# EAGLE design USB-Octomod_02 (EAGLE 6.3)
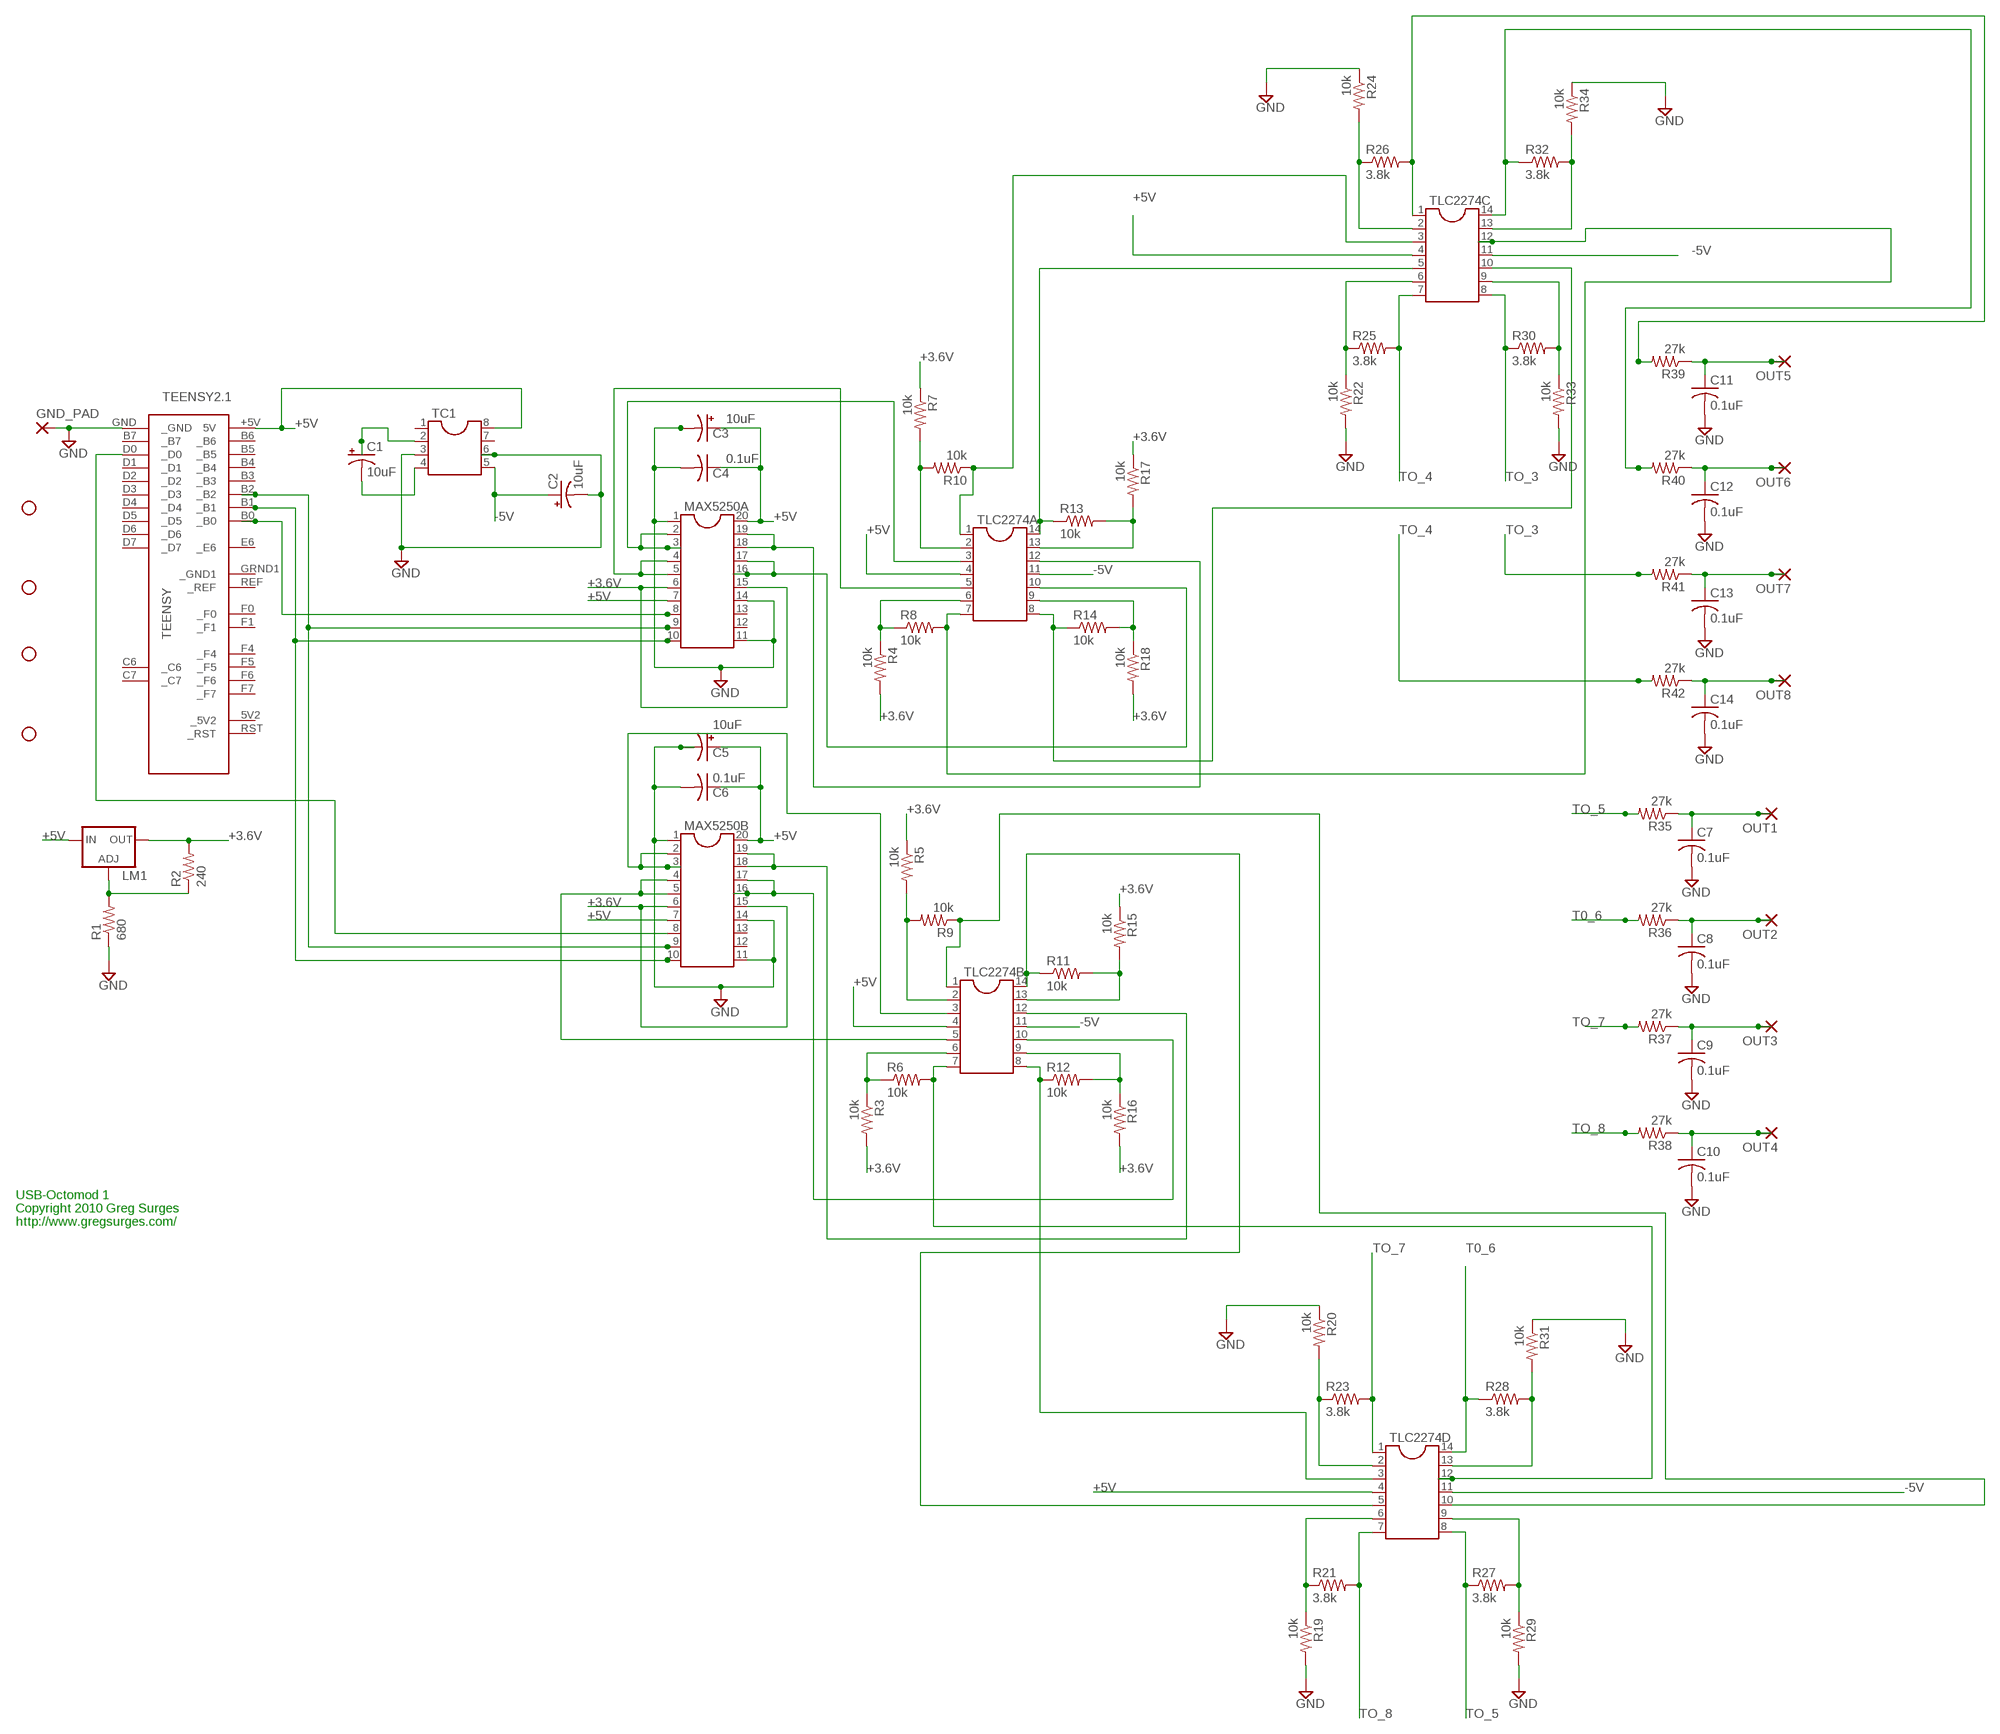
[diagram p0: schematic, sheet 1]

## Parts
C1  10uF  CPOL-USE2.5-6  [E2,5-6]
C2  10uF  CPOL-USE2.5-6  [E2,5-6]
C3  10uF  CPOL-USE2.5-6  [E2,5-6]
C4  0.1uF  C-US025-040X050  [C025-040X050]
C5  10uF  CPOL-USE2.5-6  [E2,5-6]
C6  0.1uF  C-US025-040X050  [C025-040X050]
C7  0.1uF  C-US025-040X050  [C025-040X050]
C8  0.1uF  C-US025-040X050  [C025-040X050]
C9  0.1uF  C-US025-040X050  [C025-040X050]
C10  0.1uF  C-US025-040X050  [C025-040X050]
C11  0.1uF  C-US025-040X050  [C025-040X050]
C12  0.1uF  C-US025-040X050  [C025-040X050]
C13  0.1uF  C-US025-040X050  [C025-040X050]
C14  0.1uF  C-US025-040X050  [C025-040X050]
GND_PAD  2,15/1,0  [2,15/1,0]
JP1  STAND-OFF  [STAND-OFF]
JP2  STAND-OFF  [STAND-OFF]
JP3  STAND-OFF  [STAND-OFF]
JP4  STAND-OFF  [STAND-OFF]
LM1  LM317TL  [317TL]
MAX5250A  DIL20  [DIL20]
MAX5250B  DIL20  [DIL20]
OUT1  2,15/1,0  [2,15/1,0]
OUT2  2,15/1,0  [2,15/1,0]
OUT3  2,15/1,0  [2,15/1,0]
OUT4  2,15/1,0  [2,15/1,0]
OUT5  2,15/1,0  [2,15/1,0]
OUT6  2,15/1,0  [2,15/1,0]
OUT7  2,15/1,0  [2,15/1,0]
OUT8  2,15/1,0  [2,15/1,0]
R1  680  R-US_0207/10  [0207/10]
R2  240  R-US_0207/10  [0207/10]
R3  10k  R-US_0207/10  [0207/10]
R4  10k  R-US_0207/10  [0207/10]
R5  10k  R-US_0207/10  [0207/10]
R6  10k  R-US_0207/10  [0207/10]
R7  10k  R-US_0207/10  [0207/10]
R8  10k  R-US_0207/10  [0207/10]
R9  10k  R-US_0207/10  [0207/10]
R10  10k  R-US_0207/10  [0207/10]
R11  10k  R-US_0207/10  [0207/10]
R12  10k  R-US_0207/10  [0207/10]
R13  10k  R-US_0207/10  [0207/10]
R14  10k  R-US_0207/10  [0207/10]
R15  10k  R-US_0207/10  [0207/10]
R16  10k  R-US_0207/10  [0207/10]
R17  10k  R-US_0207/10  [0207/10]
R18  10k  R-US_0207/10  [0207/10]
R19  10k  R-US_0207/10  [0207/10]
R20  10k  R-US_0207/10  [0207/10]
R21  3.8k  R-US_0207/10  [0207/10]
R22  10k  R-US_0207/10  [0207/10]
R23  3.8k  R-US_0207/10  [0207/10]
R24  10k  R-US_0207/10  [0207/10]
R25  3.8k  R-US_0207/10  [0207/10]
R26  3.8k  R-US_0207/10  [0207/10]
R27  3.8k  R-US_0207/10  [0207/10]
R28  3.8k  R-US_0207/10  [0207/10]
R29  10k  R-US_0207/10  [0207/10]
R30  3.8k  R-US_0207/10  [0207/10]
R31  10k  R-US_0207/10  [0207/10]
R32  3.8k  R-US_0207/10  [0207/10]
R33  10k  R-US_0207/10  [0207/10]
R34  10k  R-US_0207/10  [0207/10]
R35  27k  R-US_0207/10  [0207/10]
R36  27k  R-US_0207/10  [0207/10]
R37  27k  R-US_0207/10  [0207/10]
R38  27k  R-US_0207/10  [0207/10]
R39  27k  R-US_0207/10  [0207/10]
R40  27k  R-US_0207/10  [0207/10]
R41  27k  R-US_0207/10  [0207/10]
R42  27k  R-US_0207/10  [0207/10]
TC1  DIL8  [DIL08]
TEENSY2.1  TEENSY  [TEENSY]
TLC2274A  DIL14  [DIL14]
TLC2274B  DIL14  [DIL14]
TLC2274C  DIL14  [DIL14]
TLC2274D  DIL14  [DIL14]

## Nets
+3.6V: LM1.2(OUT) MAX5250A.6 MAX5250A.15 MAX5250B.6 MAX5250B.15 R2.2 R3.2 R4.2 R5.1 R7.1 R15.1 R16.2 R17.1 R18.2
+5V: C3.+ C4.1 C5.+ C6.1 LM1.3(IN) MAX5250A.7 MAX5250A.20 MAX5250B.7 MAX5250B.20 TC1.8 TEENSY2.1.+5V(5V) TLC2274A.4 TLC2274B.4 TLC2274C.4 TLC2274D.4
-5V: C2.+ TC1.5 TLC2274A.11 TLC2274B.11 TLC2274C.11 TLC2274D.11
GND: C2.- C3.- C4.2 C5.- C6.2 C7.2 C8.2 C9.2 C10.2 C11.2 C12.2 C13.2 C14.2 GND_PAD.1(P) MAX5250A.1 MAX5250A.11 MAX5250A.14 MAX5250B.1 MAX5250B.11 MAX5250B.14 R1.1 R19.2 R20.1 R22.2 R24.1 R29.2 R31.1 R33.2 R34.1 TC1.3 TC1.6 TEENSY2.1.GND(_GND)
N$1: MAX5250A.8 TEENSY2.1.B0(_B0)
N$2: MAX5250A.10 MAX5250B.10 TEENSY2.1.B1(_B1)
N$3: MAX5250A.9 MAX5250B.9 TEENSY2.1.B2(_B2)
N$4: C1.+ TC1.2
N$5: R10.1 TLC2274A.1 TLC2274C.3
N$6: LM1.1(ADJ) R1.2 R2.1
N$7: C1.- TC1.4
N$8: R7.2 R10.2 TLC2274A.2
N$9: C11.1 OUT5.1(P) R39.1
N$10: R4.1 R8.1 TLC2274A.6
N$11: R13.2 R17.2 TLC2274A.13
N$12: C12.1 OUT6.1(P) R40.1
N$13: C13.1 OUT7.1(P) R41.1
N$15: C14.1 OUT8.1(P) R42.1
N$16: R5.2 R9.2 TLC2274B.2
N$17: C7.1 OUT1.1(P) R35.1
N$18: R3.1 R6.1 TLC2274B.6
N$19: C8.1 OUT2.1(P) R36.1
N$20: C9.1 OUT3.1(P) R37.1
N$21: R11.2 R15.2 TLC2274B.13
N$22: C10.1 OUT4.1(P) R38.1
N$23: R14.2 R18.1 TLC2274A.9
N$24: R12.2 R16.1 TLC2274B.9
N$25: MAX5250B.8 TEENSY2.1.D0(_D0)
N$26: R24.2 R26.1 TLC2274C.2
N$27: R26.2 R39.2 TLC2274C.1
N$28: R32.2 R34.2 TLC2274C.13
N$29: R32.1 R40.2 TLC2274C.14
N$30: R22.1 R25.1 TLC2274C.6
N$32: R30.2 R33.1 TLC2274C.9
N$33: R20.2 R23.1 TLC2274D.2
N$35: R28.2 R31.2 TLC2274D.13
N$37: R19.1 R21.1 TLC2274D.6
N$38: R27.2 R29.1 TLC2274D.9
OUT2: R8.2 TLC2274A.7 TLC2274C.12
OUT3: R14.1 TLC2274A.8 TLC2274C.10
OUT4: R13.1 TLC2274A.14 TLC2274C.5
OUT6: R11.1 TLC2274B.14 TLC2274D.5
OUT8: R9.1 TLC2274B.1 TLC2274D.10
OUTA1: MAX5250A.2 MAX5250A.3 TLC2274A.3
OUTA2: MAX5250A.4 MAX5250A.5 TLC2274A.5
OUTA3: MAX5250A.18 MAX5250A.19 TLC2274A.12
OUTA4: MAX5250A.16 MAX5250A.17 TLC2274A.10
OUTB1: MAX5250B.2 MAX5250B.3 TLC2274B.3
OUTB2: MAX5250B.4 MAX5250B.5 TLC2274B.5
OUTB3: MAX5250B.18 MAX5250B.19 TLC2274B.12
OUTB4: MAX5250B.16 MAX5250B.17 TLC2274B.10
T0_6: R28.1 R36.2 TLC2274D.14
TO_3: R30.1 R41.2 TLC2274C.8
TO_4: R25.2 R42.2 TLC2274C.7
TO_5: R27.1 R35.2 TLC2274D.8
TO_7: R23.2 R37.2 TLC2274D.1
TO_8: R21.2 R38.2 TLC2274D.7
TT3: R12.1 TLC2274B.8 TLC2274D.3
TTT: R6.2 TLC2274B.7 TLC2274D.12
Unconnected: MAX5250A.12 MAX5250A.13 MAX5250B.12 MAX5250B.13 TC1.1 TC1.7 TEENSY2.1.5V2(_5V2) TEENSY2.1.B3(_B3) TEENSY2.1.B4(_B4) TEENSY2.1.B5(_B5) TEENSY2.1.B6(_B6) TEENSY2.1.B7(_B7) TEENSY2.1.C6(_C6) TEENSY2.1.C7(_C7) TEENSY2.1.D1(_D1) TEENSY2.1.D2(_D2) TEENSY2.1.D3(_D3) TEENSY2.1.D4(_D4) TEENSY2.1.D5(_D5) TEENSY2.1.D6(_D6) TEENSY2.1.D7(_D7) TEENSY2.1.E6(_E6) TEENSY2.1.F0(_F0) TEENSY2.1.F1(_F1) TEENSY2.1.F4(_F4) TEENSY2.1.F5(_F5) TEENSY2.1.F6(_F6) TEENSY2.1.F7(_F7) TEENSY2.1.GRND1(_GND1) TEENSY2.1.REF(_REF) TEENSY2.1.RST(_RST)

## Notes on the sheet
- USB-Octomod 1
- Copyright 2010 Greg Surges
- http://www.gregsurges.com/

## Library data of the parts
C1-C3 C5 = rcl:CPOL-US: POLARIZED CAPACITOR, American symbol
C4 C6-C14 = rcl:C-US: CAPACITOR, American symbol
GND_PAD OUT1-OUT8 = wirepad:2,15/1,0: THROUGH-HOLE PAD
JP1-JP4 = SparkFun:STAND-OFF: Stand Off This is the mechanical footprint for a #4 phillips button head screw. Use the keepout ring to avoid running the screw head into surrounding components. SKU : PRT-00447
LM1 = v-reg:LM317TL: VOLTAGE REGULATOR
MAX5250A MAX5250B = ic-package:DIL20: Dual In Line / Socket
R1-R42 = rcl:R-US_: RESISTOR, American symbol
TC1 = ic-package:DIL8: Dual In Line / Socket
TEENSY2.1 = teensy:TEENSY: Teensy 2.0
TLC2274A TLC2274B TLC2274C TLC2274D = ic-package:DIL14: Dual In Line / Socket

## Board
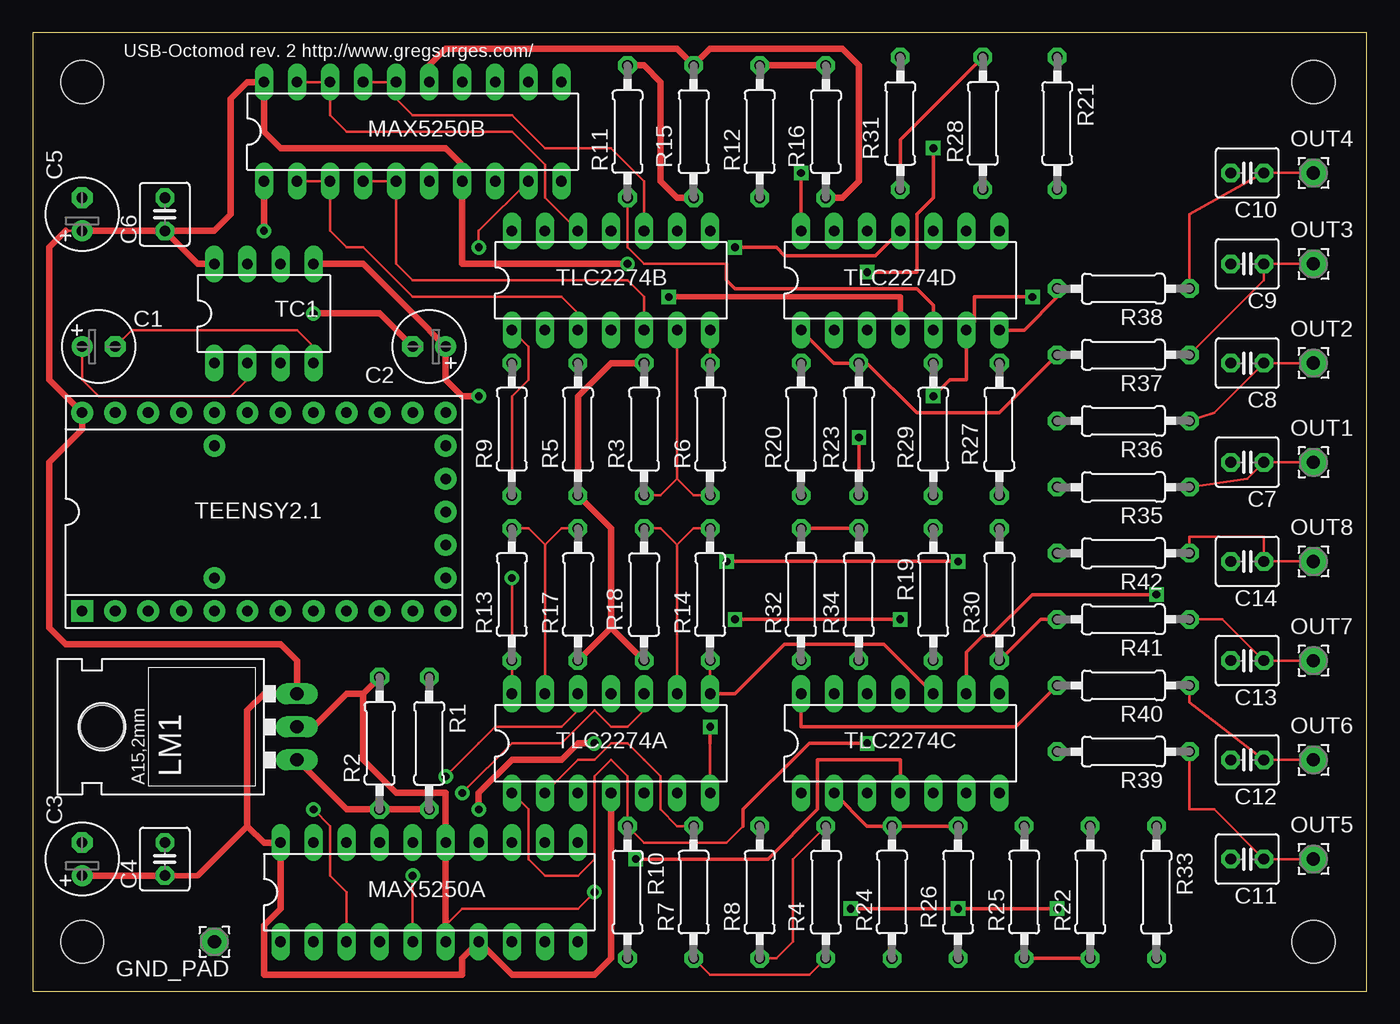
[diagram p1: board, top side]
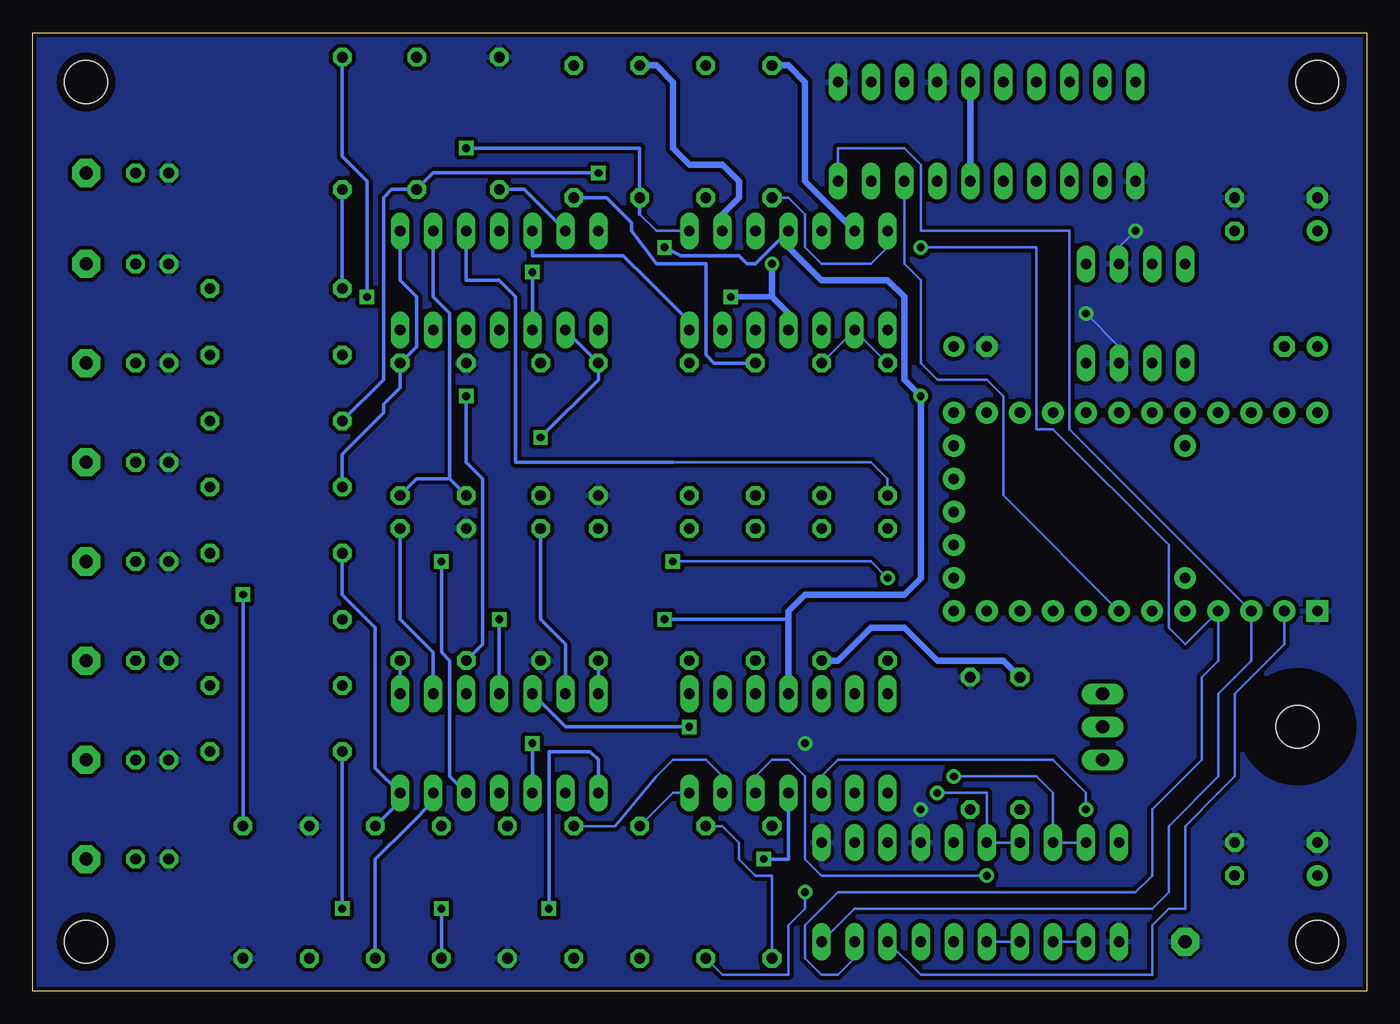
[diagram p2: board, bottom side, seen from below]

Size 102.54 x 73.65 mm. Coordinates in mm from the lower left corner, seen from the top.
Outline: 0,0 102.54,0 102.54,73.65 0,73.65 0,0
Copper layers (1*16): Top 0.035mm / dielectric 1.5mm / Bottom 0.035mm
Design rules "SparkFun": minimum track width 8mil, minimum drill 20mil, track to track 8mil, track to pad 8mil, pad to pad 8mil, via to via 8mil, smd to smd 8mil, copper to edge 10mil, drill to drill 8mil, minimum pad ring 12mil, minimum via ring 10mil, stop-mask expansion 4mil, vias tented up to drill 25mil, thermal gap 10mil

### Footprints (pad centres in the part's own frame; a part is rotated, then mirrored left to right if it is on the bottom)
E2,5-6 = drill 0.813 pad 1.6: + -1.27,0 | drill 0.813 pad 1.6 octagon: - 1.27,0
C025-040X050 = drill 0.813 octagon: 1 -1.27,0; 2 1.27,0
2,15/1,0 = drill 1.016 pad 2.159 octagon: 1 0,0
STAND-OFF = hole 3.302: 0,0
317TL = drill 1.016 long: 1 -2.54,-3.81; 2 0,-3.81; 3 2.54,-3.81 | hole 3.302: 0,11.176
DIL20 = drill 0.813 long: 1 -11.43,-3.81; 2 -8.89,-3.81; 3 -6.35,-3.81; 4 -3.81,-3.81; 5 -1.27,-3.81; 6 1.27,-3.81; 7 3.81,-3.81; 8 6.35,-3.81; 9 8.89,-3.81; 10 11.43,-3.81; 11 11.43,3.81; 12 8.89,3.81; 13 6.35,3.81; 14 3.81,3.81; 15 1.27,3.81; 16 -1.27,3.81; 17 -3.81,3.81; 18 -6.35,3.81; 19 -8.89,3.81; 20 -11.43,3.81
0207/10 = drill 0.813 octagon: 1 -5.08,0; 2 5.08,0
DIL08 = drill 0.813 long: 1 -3.81,-3.81; 2 -1.27,-3.81; 3 1.27,-3.81; 4 3.81,-3.81; 5 3.81,3.81; 6 1.27,3.81; 7 -1.27,3.81; 8 -3.81,3.81
TEENSY = drill 0.813 pad 1.676: 5V2 13.97,-2.54; +5V -13.97,7.62; B0 -11.43,-7.62; B1 -8.89,-7.62; B2 -6.35,-7.62; B3 -3.81,-7.62; B4 8.89,7.62; B5 6.35,7.62; B6 3.81,7.62; B7 -1.27,-7.62; C6 11.43,-7.62; C7 13.97,-7.62; D0 1.27,-7.62; D1 3.81,-7.62; D2 6.35,-7.62; D3 8.89,-7.62; D4 13.97,5.08; D5 13.97,-5.08; D6 13.97,7.62; D7 11.43,7.62; E6 -3.81,-5.08; F0 -11.43,7.62; F1 -8.89,7.62; F4 -6.35,7.62; F5 -3.81,7.62; F6 -1.27,7.62; F7 1.27,7.62; GRND1 13.97,0; REF -3.81,5.08; RST 13.97,2.54 | drill 0.813 pad 1.676 square: GND -13.97,-7.62
DIL14 = drill 0.813 long: 1 -7.62,-3.81; 2 -5.08,-3.81; 3 -2.54,-3.81; 4 0,-3.81; 5 2.54,-3.81; 6 5.08,-3.81; 7 7.62,-3.81; 8 7.62,3.81; 9 5.08,3.81; 10 2.54,3.81; 11 0,3.81; 12 -2.54,3.81; 13 -5.08,3.81; 14 -7.62,3.81

### Placement (x,y rotation side)
C1  5.08,49.53 0 top
C2  30.48,49.53 180 top
C3  3.81,10.16 90 top
C4  10.16,10.16 90 top
C5  3.81,59.69 90 top
C6  10.16,59.69 90 top
C7  93.34,40.64 180 top
C8  93.34,48.26 180 top
C9  93.34,55.88 180 top
C10  93.34,62.87 180 top
C11  93.34,10.16 180 top
C12  93.34,17.78 180 top
C13  93.34,25.4 180 top
C14  93.34,33.02 180 top
GND_PAD  13.97,3.81 180 top
JP1  3.81,3.81 0 top
JP2  98.42,3.81 0 top
JP3  98.42,69.85 0 top
JP4  3.81,69.85 0 top
LM1  16.51,20.32 90 top
MAX5250A  30.48,7.62 0 top
MAX5250B  29.21,66.04 0 top
OUT1  98.42,40.64 0 top
OUT2  98.42,48.26 0 top
OUT3  98.42,55.88 0 top
OUT4  98.42,62.87 0 top
OUT5  98.42,10.16 0 top
OUT6  98.42,17.78 0 top
OUT7  98.42,25.4 0 top
OUT8  98.42,33.02 0 top
R1  30.48,19.05 270 top
R2  26.67,19.05 90 top
R3  46.99,43.18 90 top
R4  60.96,7.62 270 top
R5  41.91,43.18 90 top
R6  52.07,43.18 90 top
R7  50.8,7.62 90 top
R8  55.88,7.62 90 top
R9  36.83,43.18 90 top
R10  45.72,7.62 270 top
R11  45.72,66.04 90 top
R12  55.88,66.04 90 top
R13  36.83,30.48 90 top
R14  52.07,30.48 90 top
R15  50.8,66.04 270 top
R16  60.96,66.04 270 top
R17  41.91,30.48 90 top
R18  46.99,30.48 270 top
R19  69.22,30.48 90 top
R20  59.05,43.18 90 top
R21  78.74,66.67 270 top
R22  81.28,7.62 90 top
R23  63.5,43.18 90 top
R24  66.04,7.62 90 top
R25  76.2,7.62 90 top
R26  71.12,7.62 270 top
R27  74.3,43.18 270 top
R28  73.03,66.67 90 top
R29  69.22,43.18 90 top
R30  74.3,30.48 90 top
R31  66.67,66.67 270 top
R32  59.05,30.48 90 top
R33  86.36,7.62 270 top
R34  63.5,30.48 90 top
R35  83.82,38.73 180 top
R36  83.82,43.81 180 top
R37  83.82,48.9 180 top
R38  83.82,53.98 180 top
R39  83.82,18.41 180 top
R40  83.82,23.5 180 top
R41  83.82,28.57 180 top
R42  83.82,33.66 180 top
TC1  17.78,52.07 0 top
TEENSY2.1  17.78,36.83 0 top
TLC2274A  44.45,19.05 0 top
TLC2274B  44.45,54.61 0 top
TLC2274C  66.67,19.05 0 top
TLC2274D  66.67,54.61 0 top

### Tracks (layer width: path | path; a pad name or v marks a point on that pad's centre or on a via)
+3.6V  (via drill 0.6)
  Top 0.203: 21.59,20.32 LM1.2 | MAX5250A.6 31.75,5.08 33.02,6.35 41.91,6.35 v43.18,7.62 | R7.1 52.07,1.27 59.69,1.27 R4.2
  Top 0.508: MAX5250B.15 30.48,71.12 31.75,72.39 49.53,72.39 R15.1 52.07,72.39 62.23,72.39 63.5,71.12 63.5,62.23 62.23,60.96 R16.2 | R3.2 44.45,48.26 41.91,45.72 R5.1 43.18,36.83 44.45,35.56 44.45,27.94 | R17.1 44.45,27.94 | 44.45,27.94 R18.2 | 21.59,20.32 24.13,22.86 25.4,22.86 | 25.4,22.86 R2.2 | 25.4,22.86 25.4,17.78 26.67,16.51 27.94,15.24 31.75,15.24 MAX5250A.15 MAX5250A.6
  Bottom 0.203: v43.18,7.62 43.18,6.35 44.45,5.08 44.45,1.27 49.53,1.27 R7.1
  Bottom 0.254: R3.2 50.16,48.26 50.8,48.9 50.8,55.88 54.61,55.88 56.52,58.42 56.52,59.05 58.42,60.96 R16.2
  Bottom 0.508: MAX5250B.15 MAX5250B.6 | R17.1 40.64,25.4 38.1,27.94 35.56,27.94 33.02,25.4 27.94,25.4 R2.2
+5V  (via drill 0.6)
  Top 0.203: 2.54,58.42 C5.+ | MAX5250A.7 34.8,3.3 | 33.02,1.27 33.02,1.52
  Top 0.254: v46.35,10.16 50.16,10.16 52.7,10.16 56.52,10.16 60.33,13.97 60.33,17.78 66.67,17.78 TLC2274C.4
  Top 0.406: 16.51,12.7 12.7,8.89 C4.1 | v48.9,53.34 66.67,53.34 TLC2274D.4
  Top 0.508: 2.54,58.42 1.27,57.15 1.27,46.99 TEENSY2.1.+5V 3.81,43.18 1.27,40.64 1.27,27.94 2.54,26.67 19.05,26.67 20.32,25.4 LM1.3 17.78,22.86 16.51,21.59 16.51,12.7 17.78,11.43 MAX5250A.20 19.05,8.89 19.05,6.35 17.78,5.08 17.78,1.27 33.02,1.27 | C5.+ C6.1 | C6.1 12.7,55.88 TC1.8 | C6.1 13.97,58.42 15.24,59.69 15.24,68.58 16.51,69.85 MAX5250B.20 17.78,66.04 19.05,64.77 31.75,64.77 33.02,63.5 MAX5250B.7 33.02,57.15 33.02,55.88 34.29,55.88 v45.72,55.88 | C3.+ C4.1 | TLC2274A.4 44.45,7.62 44.45,2.54 43.18,1.27 36.83,1.27 34.8,3.3 MAX5250A.7 33.02,2.54 33.02,1.52
  Bottom 0.254: TLC2274A.4 44.45,10.16 v46.35,10.16
  Bottom 0.406: 45.72,53.34 v48.9,53.34
  Bottom 0.508: v45.72,55.88 45.72,53.34 44.45,52.07 TLC2274B.4
-5V  (via drill 0.6)
  Top 0.254: v53.98,57.15 57.15,57.15 57.78,56.52 64.77,56.52 TLC2274D.11 | v53.98,28.57 v66.67,28.57
  Top 0.508: TC1.5 25.4,55.88 29.21,52.07 C2.+ 31.75,46.99 33.02,45.72 v34.29,45.72
  Bottom 0.254: TLC2274B.11 46.99,55.88 47.62,55.88 48.26,56.52 52.7,56.52 v53.98,57.15 | TLC2274A.11 44.45,28.57 v53.98,28.57 | v66.67,28.57 TLC2274C.11
  Bottom 0.508: TLC2274B.11 44.45,57.15 43.18,55.88 41.91,54.61 36.83,54.61 35.56,53.34 35.56,46.99 v34.29,45.72 34.29,31.75 35.56,30.48 43.18,30.48 44.45,29.21 44.45,28.57 TLC2274A.11
GND  (via drill 0.6)
  Top 0.508: v17.78,58.42 MAX5250B.1 | v21.59,52.07 24.13,52.07 26.67,52.07 C2.- | v34.29,13.97 34.29,15.24 36.83,17.78 40.64,17.78 41.91,19.05 v43.18,19.05
  Bottom 0.203: TC1.6 19.05,57.15 v17.78,58.42 | TC1.3 19.05,49.53 v21.59,52.07
  pour Bottom (isolate 0.305): 0,73.66 102.23,73.66 102.23,0 0,0
N$1
  Bottom 0.203: TEENSY2.1.B0 6.35,26.67 10.16,22.86 10.16,16.51 11.43,15.24 13.97,12.7 13.97,6.35 15.24,6.35 16.51,5.08 16.51,1.27 34.29,1.27 MAX5250A.8
N$2
  Bottom 0.203: MAX5250B.10 40.64,64.77 36.83,64.77 35.56,64.77 34.29,63.5 34.29,58.42 22.86,58.42 22.86,43.18 TEENSY2.1.B1 8.89,25.4 10.16,24.13 11.43,22.86 11.43,16.51 15.24,12.7 15.24,7.62 16.51,6.35 39.37,6.35 MAX5250A.10
N$3  (via drill 0.6)
  Top 0.203: v34.29,57.15 34.29,58.42 MAX5250B.9
  Bottom 0.203: MAX5250A.9 39.37,2.54 40.64,1.27 41.91,1.27 43.18,2.54 43.18,5.08 41.91,6.35 40.64,7.62 17.78,7.62 16.51,8.89 16.51,13.97 12.7,17.78 12.7,24.13 11.43,25.4 TEENSY2.1.B2 13.97,26.67 15.24,27.94 15.24,34.29 24.13,43.18 25.4,43.18 25.4,57.15 v34.29,57.15
N$4
  Top 0.203: C1.+ 3.81,46.99 5.08,45.72 15.24,45.72 16.51,46.99 TC1.2
N$5  (via drill 0.6)
  Top 0.203: TLC2274A.1 38.1,13.97 38.1,10.16 39.37,8.89 41.91,8.89 43.18,10.16 43.18,16.51 44.45,17.78 45.72,16.51 R10.1 46.99,11.43 53.34,11.43 54.61,12.7
  Top 0.254: 54.61,12.7 54.61,13.97 59.05,18.41 59.69,19.05 v64.14,19.05
  Bottom 0.254: v64.14,19.05 TLC2274C.3
N$6
  Top 0.508: LM1.1 24.13,13.97 R2.1 R1.2
N$7
  Top 0.203: C1.- 7.62,50.8 20.32,50.8 21.59,49.53 TC1.4
N$8
  Top 0.203: TLC2274A.2 41.91,17.78 43.18,17.78 44.45,19.05 45.72,19.05 46.99,17.78 48.26,16.51 48.26,13.97 49.53,12.7 R7.2
  Bottom 0.203: R10.2 45.72,8.89 46.99,8.89 48.26,10.16 48.26,11.43 49.53,12.7 R7.2
N$9
  Top 0.203: R39.1 88.9,13.97 90.81,13.97 C11.1 OUT5.1
N$10
  Top 0.203: R8.1 57.15,2.54 58.42,3.81 58.42,10.16 R4.1
  Bottom 0.203: TLC2274A.6 49.53,16.51 50.8,17.78 53.34,17.78 54.61,16.51 57.78,12.7 59.05,12.7 R4.1
N$11
  Top 0.203: R17.2 40.64,35.56 39.37,34.29 | TLC2274A.13 39.37,34.29 | R13.2 38.1,35.56 39.37,34.29
N$12
  Top 0.203: R40.1 88.9,22.23 C12.1 OUT6.1
N$13
  Top 0.203: R41.1 91.44,28.57 C13.1 OUT7.1
N$15
  Top 0.203: R42.1 88.9,34.92 94.61,34.92 C14.1 OUT8.1
N$16
  Bottom 0.203: R5.2 TLC2274B.2 R9.2
N$17
  Top 0.203: R35.1 93.34,39.37 C7.1 OUT1.1
N$18
  Top 0.203: 49.53,39.37 TLC2274B.6 | 49.53,39.37 48.26,38.1 R3.1 | R6.1 50.8,38.1 49.53,39.37
N$19
  Top 0.203: R36.1 90.81,44.45 C8.1 OUT2.1
N$20
  Top 0.203: R37.1 94.61,54.61 C9.1 OUT3.1
N$21
  Top 0.508: R11.2 46.99,71.12 48.26,69.85 48.26,62.23 49.53,60.96 R15.2
  Bottom 0.508: TLC2274B.13 43.18,62.23 43.18,69.85 44.45,71.12 R11.2
N$22
  Top 0.203: R38.1 88.9,59.69 C10.1 OUT4.1
N$23
  Top 0.203: R18.1 48.26,35.56 49.53,34.29 | TLC2274A.9 49.53,34.29 | R14.2 50.8,35.56 49.53,34.29
N$24
  Top 0.508: R12.2 R16.1
  Bottom 0.508: R12.2 54.61,71.12 53.34,69.85 53.34,64.77 52.07,63.5 49.53,63.5 48.26,62.23 48.26,60.96 49.53,59.69 TLC2274B.9
N$25
  Bottom 0.203: TEENSY2.1.D0 27.94,38.1 27.94,45.72 29.21,46.99 33.02,46.99 34.29,48.26 34.29,49.53 34.29,54.61 35.56,55.88 35.56,59.69 35.56,60.96 MAX5250B.8
N$26
  Top 0.254: TLC2274C.2 64.14,12.7 R24.2 R26.1
N$27  (via drill 0.6)
  Top 0.254: v78.74,6.35 v71.12,6.35 v62.87,6.35
  Bottom 0.254: R39.2 v78.74,6.35 | v71.12,6.35 R26.2 | TLC2274C.1 59.05,17.78 59.69,18.41 62.87,18.41 v62.87,6.35
N$28
  Top 0.254: R32.2 R34.2
  Bottom 0.254: R34.2 63.5,28.57 61.59,26.67 TLC2274C.13
N$29
  Top 0.254: TLC2274C.14 59.05,20.32 74.93,20.32 75.56,20.32 R40.2
  Bottom 0.254: R32.1 TLC2274C.14
N$30
  Top 0.254: R25.1 R22.1
  Bottom 0.254: TLC2274C.6 71.75,14.61 73.66,12.7 76.2,10.16 R25.1
N$32  (via drill 0.6)
  Top 0.254: TLC2274C.9 71.75,26.04 73.03,27.3 73.66,27.3 76.83,30.48 v86.36,30.48
  Bottom 0.254: R30.2 74.3,28.57 71.75,26.04 TLC2274C.9 | v86.36,30.48 R33.1
N$33  (via drill 0.6)
  Top 0.254: v63.5,42.55 R23.1
  Bottom 0.254: TLC2274D.2 R20.2 59.05,46.99 v63.5,42.55
N$35
  Top 0.254: R31.2 66.67,65.41 R28.2
  Bottom 0.254: R31.2 64.77,61.59 TLC2274D.13
N$37  (via drill 0.6)
  Top 0.254: v76.83,53.34 72.39,53.34 72.39,51.44 TLC2274D.6 71.75,46.99 70.48,46.99 v69.22,45.72
  Bottom 0.254: R21.1 78.74,64.14 76.83,62.23 v76.83,53.34 | v69.22,45.72 69.22,40.64 67.94,39.37 67.94,27.3 67.94,26.67 R19.1
N$38
  Bottom 0.254: TLC2274D.9 71.75,53.34 70.48,52.07 70.48,40.01 70.48,39.37 | 70.48,39.37 R29.1 | 70.48,39.37 73.03,39.37 R27.2
OUT2  (via drill 0.6)
  Top 0.203: TLC2274A.7 52.07,19.05
  Top 0.254: v52.07,20.32 52.07,19.05
  Bottom 0.203: TLC2274A.7 53.34,15.24 R8.2
  Bottom 0.254: TLC2274C.12 61.59,20.32 v52.07,20.32
OUT3
  Top 0.203: TLC2274A.8 R14.1
  Top 0.254: TLC2274A.8 53.98,22.86 57.78,26.67 65.41,26.67 TLC2274C.10
OUT4  (via drill 0.6)
  Top 0.203: v36.83,31.75 R13.1 TLC2274A.14
  Top 0.254: v53.34,33.02 v71.12,33.02
  Bottom 0.203: v53.34,33.02 38.1,33.02 v36.83,31.75
  Bottom 0.254: v71.12,33.02 71.12,26.04 70.48,25.4 70.48,17.78 70.48,16.51 TLC2274C.5
OUT6
  Top 0.203: R11.1 45.72,57.15 46.99,55.88 53.34,55.88
  Top 0.254: 53.34,55.88 53.34,54.61 53.98,53.98 67.94,53.98 69.22,52.7 TLC2274D.5
  Bottom 0.203: TLC2274B.14 36.83,57.15 38.1,55.88 41.91,55.88 43.18,57.15 43.18,59.69 44.45,60.96 R11.1
OUT8
  Top 0.203: TLC2274B.1 38.1,49.53 38.1,46.99 36.83,45.72 R9.1
  Bottom 0.203: 53.34,40.64 38.1,40.64 36.83,39.37 R9.1
  Bottom 0.254: TLC2274D.10 69.22,54.61 66.67,54.61 65.41,53.34 65.41,46.99 65.41,40.64 53.34,40.64
OUTA1  (via drill 0.6)
  Top 0.203: MAX5250A.3 24.13,7.62 22.86,8.89 22.86,12.7 v21.59,13.97
  Bottom 0.203: MAX5250A.2 MAX5250A.3 | v21.59,13.97 21.59,15.24 24.13,17.78 40.64,17.78 41.91,16.51 TLC2274A.3
OUTA2  (via drill 0.6)
  Top 0.203: MAX5250A.5 v29.21,8.89
  Bottom 0.203: v29.21,8.89 41.91,8.89 43.18,10.16 43.18,16.51 44.45,17.78 45.72,17.78 46.99,16.51 TLC2274A.5 | MAX5250A.4 MAX5250A.5
OUTA3  (via drill 0.6)
  Top 0.203: v31.75,16.51 34.29,19.05 35.56,20.32 40.64,20.32 41.91,21.59 TLC2274A.12
  Bottom 0.203: v31.75,16.51 25.4,16.51 24.13,15.24 MAX5250A.18 MAX5250A.19
OUTA4  (via drill 0.6)
  Top 0.203: v33.02,15.24 36.83,19.05 40.64,19.05 43.18,21.59 44.45,20.32 45.72,20.32 46.99,21.59 TLC2274A.10
  Bottom 0.203: v33.02,15.24 29.21,15.24 MAX5250A.16 MAX5250A.17
OUTB1
  Top 0.203: MAX5250B.2 MAX5250B.3 22.86,58.42 24.13,57.15 25.4,57.15 29.21,53.34 40.64,53.34 41.91,52.07 TLC2274B.3
OUTB2
  Top 0.203: MAX5250B.4 MAX5250B.5 27.94,55.88 29.21,54.61 45.72,54.61 46.99,53.34 TLC2274B.5
OUTB3
  Top 0.203: MAX5250B.19 MAX5250B.18 22.86,67.31 24.13,66.04 31.75,66.04 34.29,66.04 36.83,66.04 39.37,63.5 39.37,60.96 TLC2274B.12
OUTB4
  Top 0.203: MAX5250B.17 MAX5250B.16 27.94,68.58 29.21,67.31 35.56,67.31 36.83,67.31 39.37,64.77 44.45,64.77 46.99,62.23 TLC2274B.10
T0_6  (via drill 0.6)
  Top 0.254: TLC2274D.14 v59.05,62.87
  Bottom 0.254: v59.05,62.87 71.75,62.87 R28.1 74.93,61.59 75.56,60.96 75.56,46.99 R36.2
TO_3
  Top 0.254: R41.2 77.47,28.57 R30.1
  Bottom 0.254: R30.1 TLC2274C.8
TO_4
  Bottom 0.254: R42.2 78.74,30.48 76.2,27.94 76.2,17.14 TLC2274C.7 74.3,14.61 R25.2
TO_5
  Bottom 0.254: TLC2274D.8 74.3,54.61 73.03,53.34 73.03,49.53 R27.1 74.3,46.35 75.56,45.09 75.56,44.45 78.74,41.27 R35.2
TO_7
  Top 0.254: TLC2274D.1 61.59,48.26 R23.2 64.14,48.26 67.94,44.45 74.3,44.45 R37.2
TO_8
  Top 0.254: TLC2274D.7 76.2,50.8 78.74,53.34 R38.2
  Bottom 0.254: R21.2 R38.2
TT3  (via drill 0.6)
  Top 0.254: v69.22,64.77 69.22,60.96 67.94,59.69 67.94,55.24 v64.14,55.24
  Bottom 0.203: R12.1 55.88,59.69 54.61,58.42 TLC2274B.8
  Bottom 0.254: 55.88,59.69 55.88,64.77 v69.22,64.77 | v64.14,55.24 TLC2274D.3
TTT
  Top 0.203: R6.2 TLC2274B.7
  Bottom 0.254: TLC2274B.7 52.07,51.44 55.24,54.61 57.15,56.52 64.14,56.52 TLC2274D.12

### Text on the board
tNames: USB-Octomod rev. 2 http://www.gregsurges.com/